# Altium schematic sheet 02_MISC.SchDoc
size A3
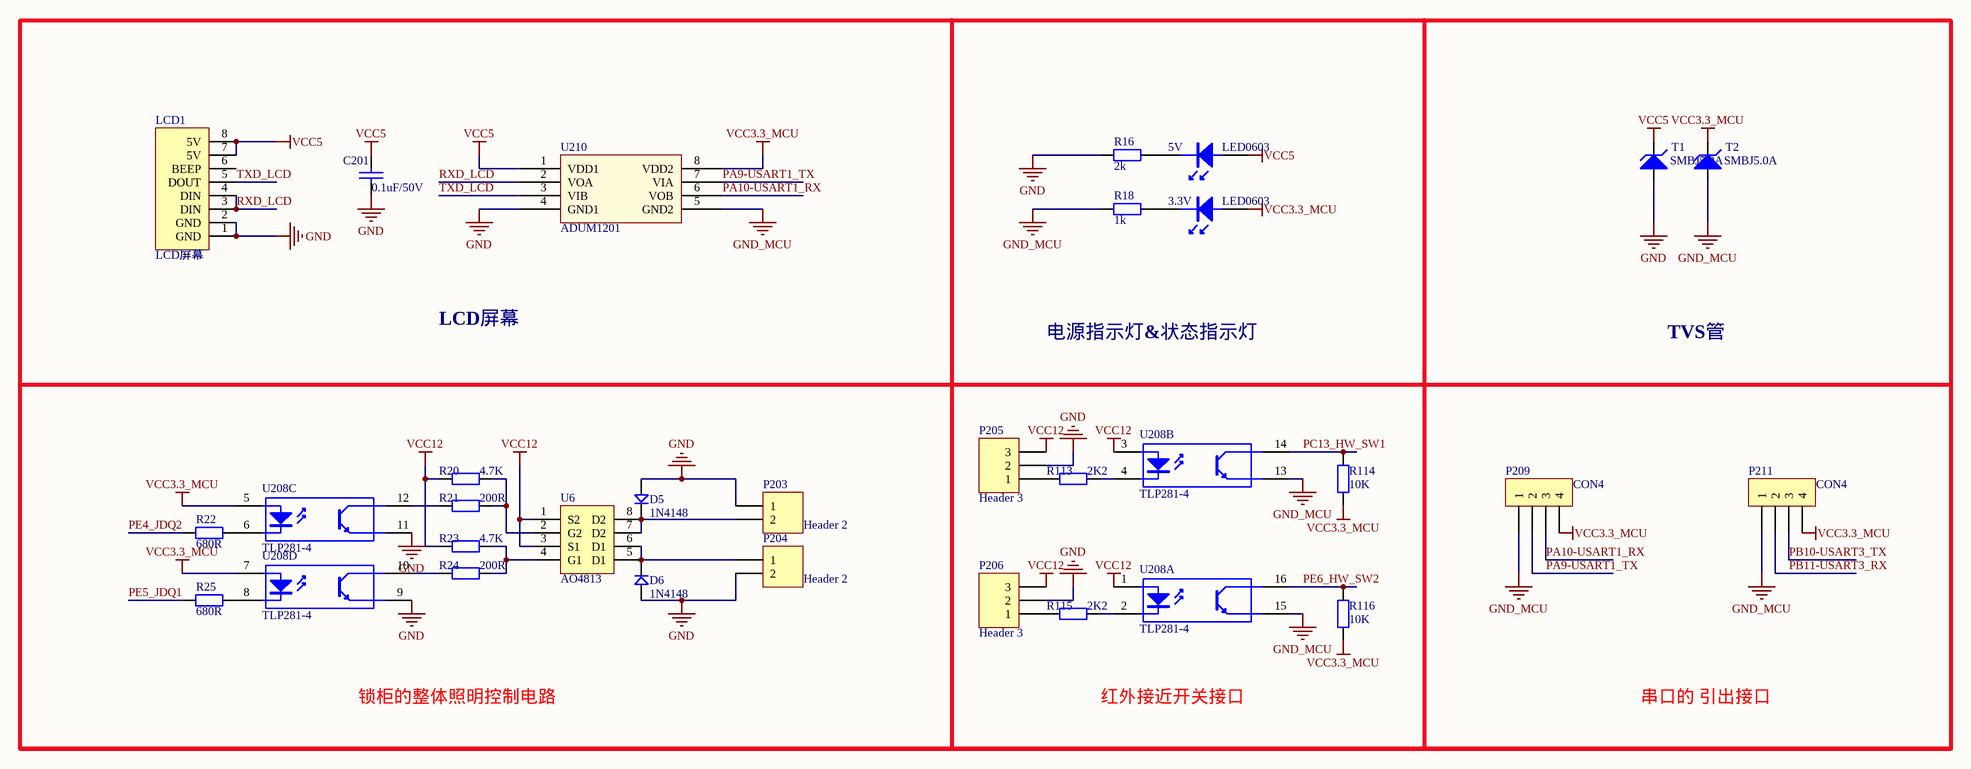
[diagram p0: 02_MISC.SchDoc]

## Parts
3.3V  LED0603  [0603LED]
5V  LED0603  [0603LED]
C201  0.1uF/50V  [0805C]
D5  1N4148  [D1812]
D6  1N4148  [D1812]
LCD1  LCD屏幕  [lcd_JIEKOU]
P203  Header 2  [HEAD2L-0.8]
P204  Header 2  [HEAD2L-0.8]
P205  Header 3  [HDR1X3]
P206  Header 3  [HDR1X3]
P209  CON4  [SIP4]
P211  CON4  [SIP4]
R16  2k  [0603R]
R18  1k  [0603R]
R20  4.7K  [0603R]
R21  200R  [0603R]
R22  680R  [0603R]
R23  4.7K  [0603R]
R24  200R  [0603R]
R25  680R  [0603R]
R113  2K2  [0603R]
R114  10K  [0603R]
R115  2K2  [0603R]
R116  10K  [0603R]
T1  SMBJ5.0A  [D1812]
T2  SMBJ5.0A  [D1812]
U6  AO4813  [SO-8]
U208  TLP281-4  [SO-16]  (parts A,B,C,D of 4)
U210  ADUM1201  [SOP_8]

## Nets
GND: C201.2 D5.1 D6.1 LCD1.1(GND) LCD1.2(GND) P203.1 P204.2 P205.2 P206.2 R16.1 T1.1(A) U208.9(E) U208.11(E) U210.4(GND1)
GND_MCU: P209.1 P211.1 R18.1 T2.1(A) U208.13(E) U208.15(E) U210.5(GND2)
VCC3.3_MCU: 3.3V.2(+) P209.4 P211.4 R114.1 R116.1 T2.2(K) U208.5(A) U208.7(A) U210.8(VDD2)
VCC5: 5V.2(+) C201.1 LCD1.7(5V) LCD1.8(5V) T1.2(K) U210.1(VDD1)
VCC12: P205.3 P206.3 R20.2 R23.2 U6.1(S2) U6.3(S1) U208.1(A) U208.3(A)
PA9-USART1_TX: P209.2 U210.7(VIA)
PA10-USART1_RX: P209.3 U210.6(VOB)
PB10-USART3_TX: P211.3
PB11-USART3_RX: P211.2
PC13_HW_SW1: R114.2 U208.14(C)
PE4_JDQ2: R22.1
PE5_JDQ1: R25.1
PE6_HW_SW2: R116.2 U208.16(C)
RXD_LCD: LCD1.3(DIN) LCD1.4(DIN) U210.2(VOA)
TXD_LCD: LCD1.5(DOUT) U210.3(VIB)
Net3.3V_1: 3.3V.1(-) R18.2
Net5V_1: 5V.1(-) R16.2
NetD5_2: D5.2 P203.2 U6.7(D2) U6.8(D2)
NetD6_2: D6.2 P204.1 U6.5(D1) U6.6(D1)
NetP205_1: P205.1 R113.1
NetP206_1: P206.1 R115.1
NetR20_1: R20.1 R21.2 U6.2(G2)
NetR21_1: R21.1 U208.12(C)
NetR22_2: R22.2 U208.6(K)
NetR23_1: R23.1 R24.2 U6.4(G1)
NetR24_1: R24.1 U208.10(C)
NetR25_2: R25.2 U208.8(K)
NetR113_2: R113.2 U208.4(K)
NetR115_2: R115.2 U208.2(K)

Not connected (* = marked no-connect by the designer): LCD1 6(BEEP)

## Notes on the sheet
- LCD屏幕
- 电源指示灯&状态指示灯
- TVS管
- 锁柜的整体照明控制电路
- 红外接近开关接口
- 串口的 引出接口

## Library data of the parts
3.3V 5V = LED_SMD: 贴片LED
C201 = CAP: Capacitor
D5 D6 = D
LCD1 = Component_1
P203 P204 = Header 2: Header, 2-Pin; LatestRevisionDate: 17-Jul-2002; LatestRevisionNote: Re-released for DXP Platform.; Publisher: Altium Limited
P205 P206 = Header 3: Header, 3-Pin; LatestRevisionDate: 17-Jul-2002; LatestRevisionNote: Re-released for DXP Platform.; Publisher: Altium Limited
P209 P211 = CON4: Connector
R16 = Res1: 贴片电阻; Value: 1K; Published: 8-Jun-2000; LatestRevisionDate: 17-Jul-2002; LatestRevisionNote: Re-released for DXP Platform.; PackageReference: AXIAL-0.4; Publisher: Altium Limited
R18 = Res1: 贴片电阻; Published: 8-Jun-2000; LatestRevisionDate: 17-Jul-2002; LatestRevisionNote: Re-released for DXP Platform.; PackageReference: AXIAL-0.4; Publisher: Altium Limited; Value: 1K
R20-R25 R113-R116 = 0603 2.7KΩ (2701) 1%: 贴片电阻; ComponentLink1Description: 供应商链接; ComponentLink1URL: http://www.szlcsc.com/product/details_13814.html; Package: 0603; Supplier: LC; SuppliersPartNumber: C13167
T1 T2 = SS36: Zener Diode
U6 = NDS8434
U208 = TP521-4_1
U210 = ADUM1201: 串口隔离